# Altium schematic sheet SCH_Clock_Iot.SchDoc
size A3
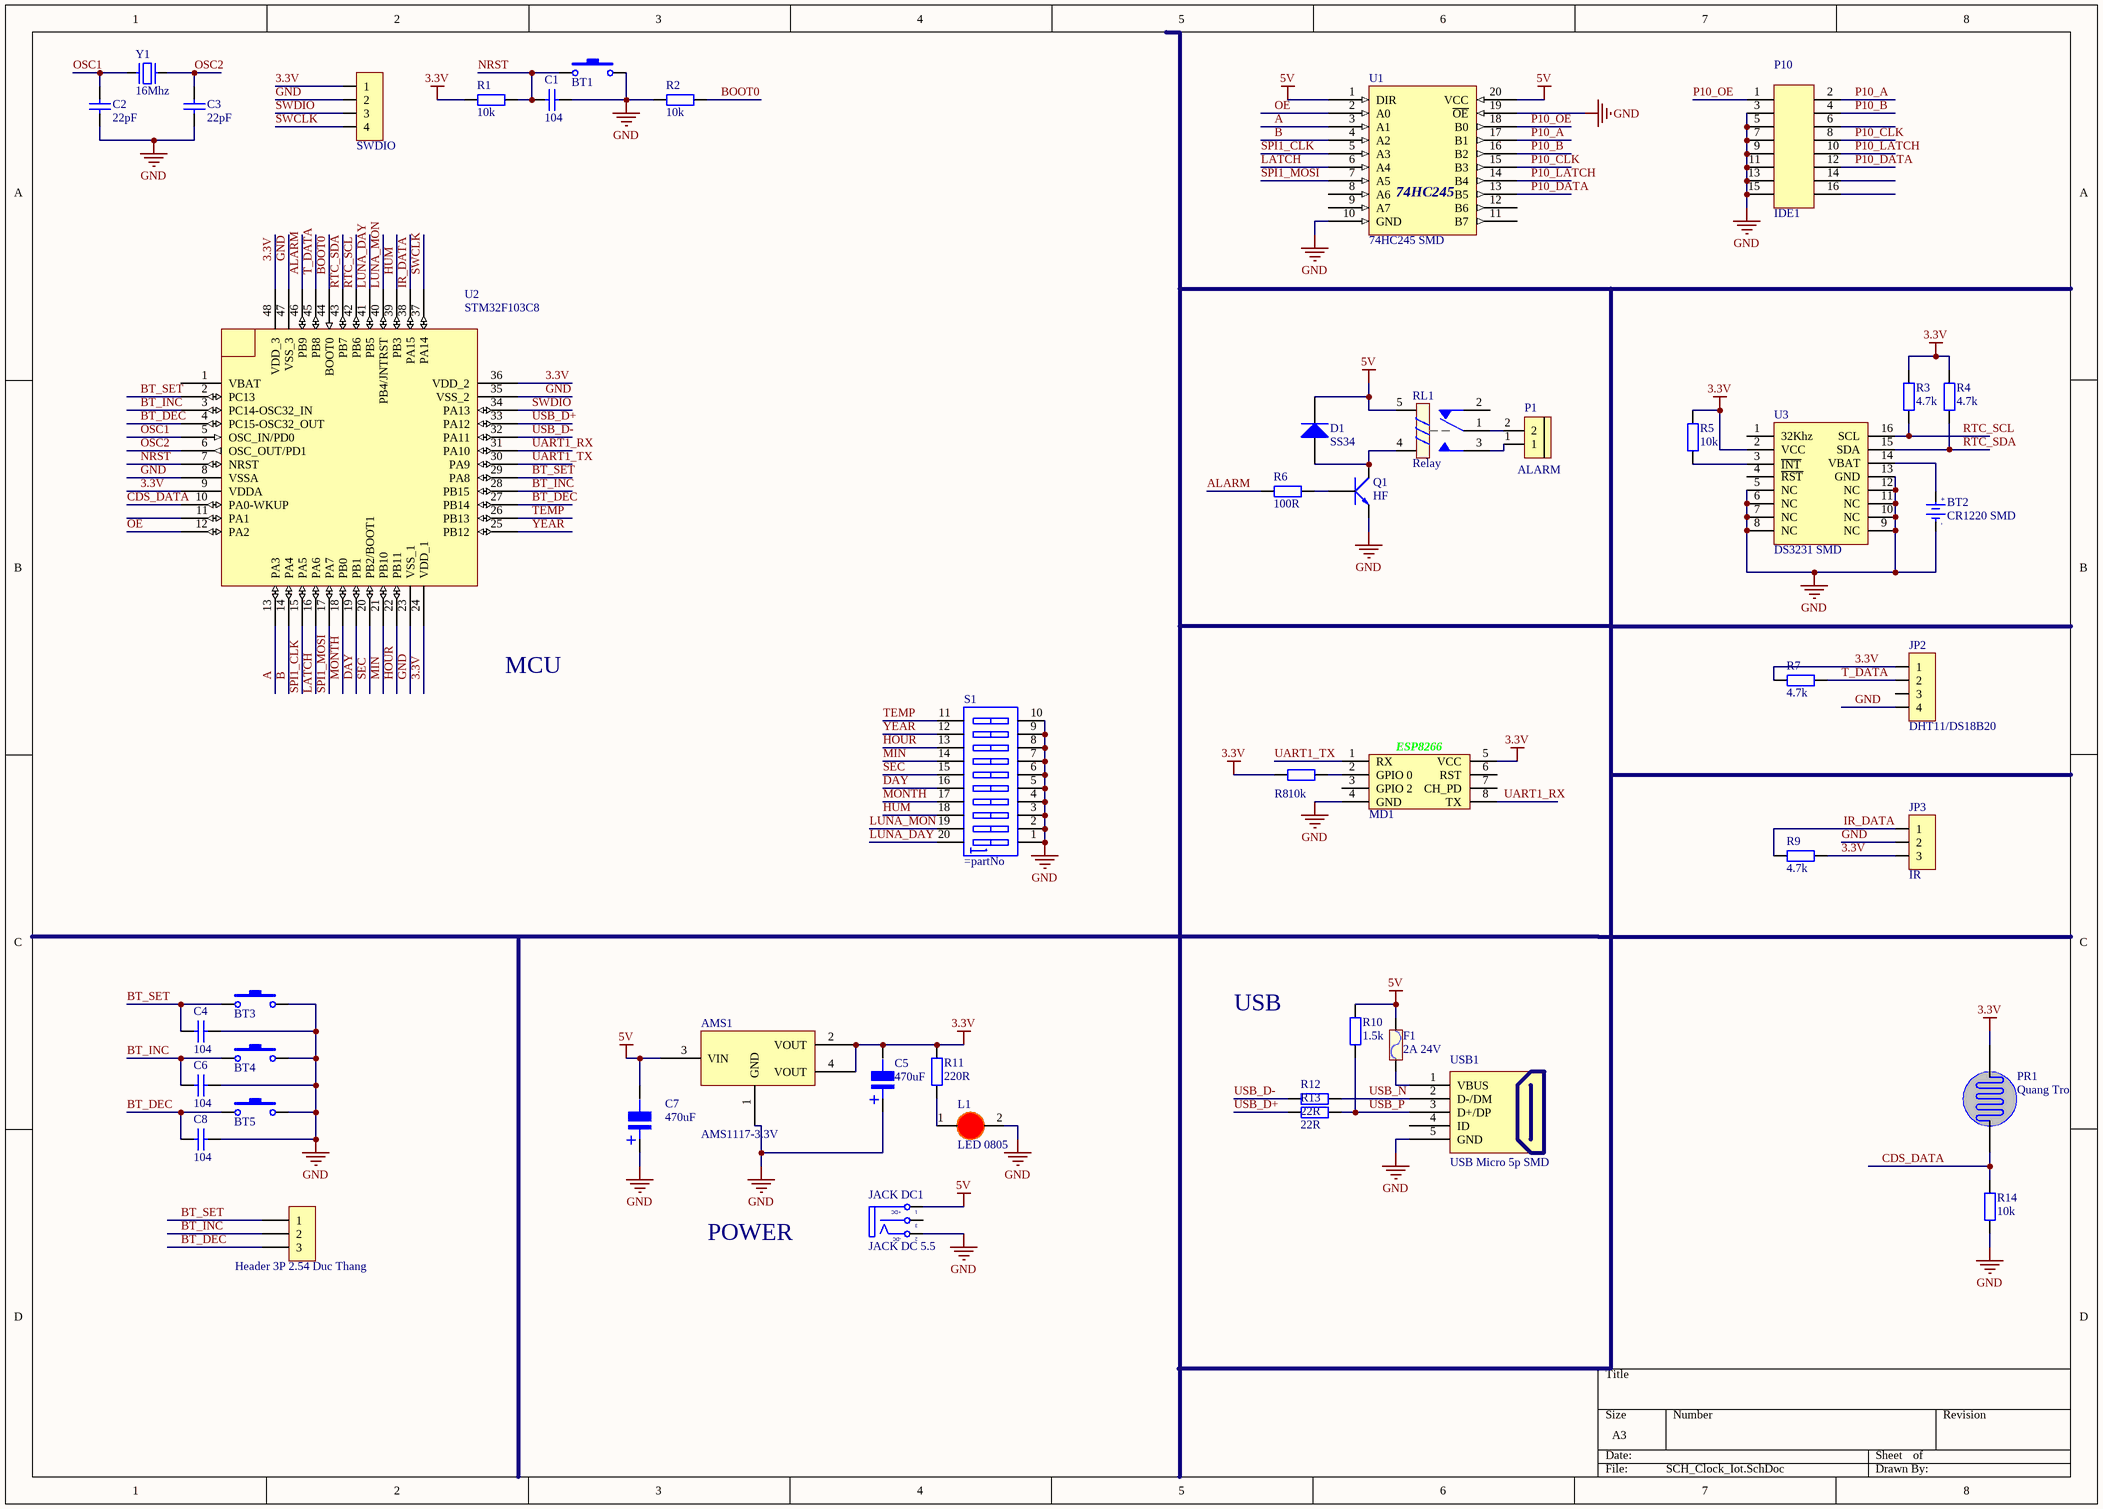
[diagram p0: SCH_Clock_Iot.SchDoc]

## Parts
AMS1  AMS1117-3.3V  [SOT223]
BT1  Nut Nhan 2 Chan SMD 3x6x2.5  [Nut Nhan 2 Chan SMD 3x6x2.5]  (value not drawn)
BT2  CR1220 SMD  [DE PIN CR1220]
BT3  Nut Nhan 2 Chan SMD 3x6x2.5  [Nut Nhan 2 Chan SMD 3x6x2.5]  (value not drawn)
BT4  Nut Nhan 2 Chan SMD 3x6x2.5  [Nut Nhan 2 Chan SMD 3x6x2.5]  (value not drawn)
BT5  Nut Nhan 2 Chan SMD 3x6x2.5  [Nut Nhan 2 Chan SMD 3x6x2.5]  (value not drawn)
C1  104  [tu 0805]
C2  22pF  [tu 0805]
C3  22pF  [tu 0805]
C4  104  [tu 0805]
C5  470uF  [tu nhom 8 (f)]
C6  104  [tu 0805]
C7  470uF  [tu nhom 8 (f)]
C8  104  [tu 0805]
D1  SS34  [DIODE SMA]
F1  2A 24V  [Cau chi tu phuc hoi 2A 24V SMD1812]
H1  Header 3P 2.54 Duc Thang  [Header DT 3P_2.54]
IDE1  P10  [IDE16 DT]
JACK_DC1  JACK DC 5.5  [JACK DC 5.5]
JP1  SWDIO  [JP 1x4 DT]
JP2  DHT11/DS18B20  [JP 1x4 CT]
JP3  IR  [JP 1x3 CT]
L1  LED 0805  [LED-0805-Red]
MD1  ESP8266 Module  [ESP2866 Module]  (value not drawn)
P1  ALARM  [CON 2 2EDG5.08]
PR1  Quang Tro  [Quang Tro]
Q1  HF  [SOT23]
R1  10k  [tro smd 0805]
R2  10k  [tro smd 0805]
R3  4.7k  [tro smd 0805]
R4  4.7k  [tro smd 0805]
R5  10k  [tro smd 0805]
R6  100R  [tro smd 0805]
R7  4.7k  [tro smd 0805]
R8  10k  [tro smd 0805]
R9  4.7k  [tro smd 0805]
R10  1.5k  [tro smd 0805]
R11  220R  [tro smd 0805]
R12  22R  [tro smd 0805]
R13  22R  [tro smd 0805]
R14  10k  [tro smd 0805]
RL1  Relay  [Relay 5 Chan SRD]
S1  (no value)  [SW-DIP10-1]
U1  74HC245 SMD  [TSSOP20]
U2  STM32F103C8  [STM32_LQPF48]
U3  DS3231 SMD  [SOIC 16]
USB1  USB Micro 5p SMD  [USB Micro 5p SMD]
Y1  16Mhz  [Thach Anh 2 chan cam]

## Nets
3.3V: AMS1.2(VOUT) AMS1.4(VOUT) C5.2 JP1.1 JP2.1 JP3.3 MD1.5(VCC) PR1.2 R1.2 R3.2 R4.2 R5.2 R7.2 R8.2 R9.1 R11.2 U2.9(VDDA) U2.24(VDD_1) U2.36(VDD_2) U2.48(VDD_3) U3.2(VCC)
5V: AMS1.3(VIN) C7.2 D1.2(K) F1.2 JACK_DC1.1(T) R10.1 RL1.5 U1.1(DIR) U1.20(VCC)
GND: AMS1.1(GND) BT1.2 BT2.2(GND) BT3.2 BT4.2 BT5.2 C1.2 C2.2 C3.2 C4.2 C5.1 C6.2 C7.1 C8.2 IDE1.3 IDE1.5 IDE1.7 IDE1.9 IDE1.11 IDE1.13 IDE1.15 JACK_DC1.2(TN) JP1.2 JP2.4 JP3.2 L1.2(K) MD1.4(GND) Q1.2(E) R2.2 R14.1 S1.1 S1.2 S1.3 S1.4 S1.5 S1.6 S1.7 S1.8 S1.9 S1.10 U1.10(GND) U1.19(~{OE}) U2.8(VSSA) U2.23(VSS_1) U2.35(VSS_2) U2.47(VSS_3) U3.5(NC) U3.6(NC) U3.7(NC) U3.8(NC) U3.9(NC) U3.10(NC) U3.11(NC) U3.12(NC) U3.13(GND) USB1.5(GND)
A: U1.3(A1) U2.13(PA3)
ALARM: R6.1 U2.46(PB9)
B: U1.4(A2) U2.14(PA4)
BOOT0: R2.1 U2.44(BOOT0)
BT_DEC: BT5.1 C8.1 H1.3 U2.4(PC15-OSC32_OUT) U2.27(PB14)
BT_INC: BT4.1 C6.1 H1.2 U2.3(PC14-OSC32_IN) U2.28(PB15)
BT_SET: BT3.1 C4.1 H1.1 U2.2(PC13) U2.29(PA8)
CDS_DATA: PR1.1 R14.2 U2.10(PA0-WKUP)
DAY: S1.16 U2.19(PB1)
HOUR: S1.13 U2.22(PB11)
HUM: S1.18 U2.39(PB3)
IR_DATA: JP3.1 R9.2 U2.38(PA15)
LATCH: U1.6(A4) U2.16(PA6)
LUNA_DAY: S1.20 U2.41(PB5)
LUNA_MON: S1.19 U2.40(PB4/JNTRST)
MIN: S1.14 U2.21(PB10)
MONTH: S1.17 U2.18(PB0)
NRST: BT1.1 C1.1 R1.1 U2.7(NRST)
OE: U1.2(A0) U2.12(PA2)
OSC1: C2.1 U2.5(OSC_IN/PD0) Y1.1
OSC2: C3.1 U2.6(OSC_OUT/PD1) Y1.2
P10_A: IDE1.2 U1.17(B1)
P10_B: IDE1.4 U1.16(B2)
P10_CLK: IDE1.8 U1.15(B3)
P10_DATA: IDE1.12 U1.13(B5)
P10_LATCH: IDE1.10 U1.14(B4)
P10_OE: IDE1.1 U1.18(B0)
RTC_SCL: R3.1 U2.42(PB6) U3.16(SCL)
RTC_SDA: R4.1 U2.43(PB7) U3.15(SDA)
SEC: S1.15 U2.20(PB2/BOOT1)
SPI1_CLK: U1.5(A3) U2.15(PA5)
SPI1_MOSI: U1.7(A5) U2.17(PA7)
SWCLK: JP1.4 U2.37(PA14)
SWDIO: JP1.3 U2.34(PA13)
T_DATA: JP2.2 R7.1 U2.45(PB8)
TEMP: S1.11 U2.26(PB13)
UART1_RX: MD1.8(TX) U2.31(PA10)
UART1_TX: MD1.1(RX) U2.30(PA9)
USB_D+: R13.1 U2.33(PA12)
USB_D-: R12.1 U2.32(PA11)
USB_N: R12.2 USB1.2(D-/DM)
USB_P: R10.2 R13.2 USB1.3(D+/DP)
YEAR: S1.12 U2.25(PB12)
NetBT2_1: BT2.1(+3V) U3.14(VBAT)
NetD1_1: D1.1(A) Q1.3(C) RL1.4
NetF1_1: F1.1 USB1.1(VBUS)
NetL1_1: L1.1(A) R11.1
NetMD1_2: MD1.2(GPIO_0) R8.1
NetP1_1: P1.1 RL1.3
NetP1_2: P1.2 RL1.1
NetQ1_1: Q1.1(B) R6.2
NetR5_1: R5.1 U3.3(~{INT})

Not connected (* = marked no-connect by the designer): IDE1 6 14 16(14); JACK_DC1 3(S); JP2 3; MD1 3(GPIO_2) 6(RST) 7(CH_PD); RL1 2; U1 8(A6) 9(A7) 11(B7) 12(B6); U2 1(VBAT) 11(PA1); U3 1(32Khz) 4(~{RST}); USB1 4(ID)

## Notes on the sheet
- MCU
- USB
- POWER
- (in symbol 74HC245 SMD) 74HC245
- (in symbol De pin CR1220 SMD) +; -
- (in symbol ESP8266 Module) ESP8266
- (in symbol JACK DC 5.5) +DC; -DC
- (in symbol Tu Nhom 470uF 16V) +

## Library data of the parts
AMS1 = AMS1117 SMD: Dán; Value: AMS1117-3.3V SOT223; Don_Vi: Con; Ma_Hang: MH000596; Ghi_Chu: *; Kieu_Chan: *; Chung_Loai: Dán
BT1 BT3-BT5 = Nut Nhan 2 Chan SMD 3x6x2.5: Ma_Hang: MH001036; Ten: Nút Nhấn 2 Chân 3x6x2.5MM SMD
BT2 = De pin CR1220 SMD: Ten: Đế PIN CR1220 SMD; Ma_Hang: MH000833
C1 C4 C6 C8 = Tu 0805 104 50V 10%: Dán; Don_Vi: Con; So_Chan: 2; Ten_Linh_Kien: Tụ 0805 104-100nF 10% 50V; Ma_Hang: MH004551; Chung_Loai: Dán; Kieu_Chan: *
C2 C3 = Tu 0805 22pF 50V 10%: Dán; Don_Vi: Con; So_Chan: 2; Ten_Linh_Kien: Tụ 0805 22P 10% 50V; Ma_Hang: MH004560; Chung_Loai: Dán; Kieu_Chan: *
C5 C7 = Tu Nhom 470uF 16V: Dán; Don_Vi: Con; So_Chan: 2; Ten_Linh_Kien: Tụ Nhôm 470uF 16V 8x10.4MM; Ma_Hang: MH001940; Chung_Loai: Dán; Kieu_Chan: *
D1 = Diode SS34 ( 1N5822 ): Dán; Don_Vi: Con; Ma_Hang: MH002104; Ten_Linh_Kien: Diode SS34 3A 40V SMA ( 1N5822 SS34A); Kieu_Chan: *; Chung_Loai: Dán
F1 = Cau chi tu phuc hoi 2A 24V SMD1812: 2A 24V SMD1812; Ma_Hang: MH010033; Ten: Cầu Chì Tự Phục Hồi 2A 24V SMD1812
H1 = Header 3P 2.54 Duc Thang: Cắm; Ten_Linh_Kien: Header 3P XH2.54-3P Đực Thẳng; Don_Vi: Con; Ma_Hang: MH001292; Chung_Loai: Cắm
IDE1 = IDE 16 DT
JACK_DC1 = JACK DC 5.5: Value: Jac DC
JP1 = JP 1x4 2.54 Duc Thang: Cắm; Ten_Linh_Kien: Jump Đơn Đực 2.54MM 1x40P Thẳng 11MM; Don_Vi: Con; Ma_Hang: MH000903; Ghi_Chu: *; Kieu_Chan: *; Chung_Loai: Cắm
JP2 = JP 1x4 2.54 Cai Thang: Cắm; Ten_Linh_Kien: Jump Đơn Cái 2.54MM 1x20P Thẳng; Don_Vi: Con; Ma_Hang: MH004006; Ghi_Chu: *; Kieu_Chan: *; Chung_Loai: Cắm
JP3 = JP 1x3 2.54 Cai Thang: Cắm; Ten_Linh_Kien: Jump Đơn Cái 2.54MM 1x20P Thẳng; Don_Vi: Con; Ma_Hang: MH004006; Ghi_Chu: *; Kieu_Chan: *; Chung_Loai: Cắm
L1 = LED 0805 Do: Dán; Don_Vi: Con; Ma_Hang: MH000897; Ten_Linh_Kien: LED 0805 Màu Đỏ (Red); Ghi_Chu: *; Kieu_Chan: *; Chung_Loai: Dán
P1 = CON 2 EDG5.08: Cắm; Ten_Linh_Kien: CON 2 2EDG5.08-2P 5.08MM ( Xanh Cong); Don_Vi: Con; Ma_Hang: MH000759; Ghi_Chu: *; Kieu_Chan: *; Chung_Loai: Cắm
PR1 = Quang Tro: Photoresistor; Creator: Bien Nguyen
Q1 = C1815 HF SMD: NPN transistor; Value: C9014
R1 R2 R5 R8 R14 = Tro 0805 5% 10k: Dán; Don_Vi: Con; So_Chan: 2; Ten_Linh_Kien: Trở 0805 5% 10k; Ma_Hang: MH005239; Chung_Loai: Dán; Kieu_Chan: *
R3 R4 R7 R9 = Tro 0805 5% 4.7k: Dán; Don_Vi: Con; So_Chan: 2; Ten_Linh_Kien: Trở 0805 5% 4.7k; Ma_Hang: MH005307; Chung_Loai: Dán; Kieu_Chan: *
R6 = Tro 0805 5% 100R: Dán; Don_Vi: Con; So_Chan: 2; Ten_Linh_Kien: Trở 0805 5% 100R; Ma_Hang: MH005251; Chung_Loai: Dán; Kieu_Chan: *
R10 = Tro 0805 5% 1.5k: Dán; Don_Vi: Con; So_Chan: 2; Ten_Linh_Kien: Trở 0805 5% 1.5k; Ma_Hang: MH005232; Chung_Loai: Dán; Kieu_Chan: *
R11 = Tro 0805 5% 220R: Dán; Don_Vi: Con; So_Chan: 2; Ten_Linh_Kien: Trở 0805 5% 220R; Ma_Hang: MH005259; Chung_Loai: Dán; Kieu_Chan: *
R12 R13 = Tro 0805 5% 22R: Dán; Don_Vi: Con; So_Chan: 2; Ten_Linh_Kien: Trở 0805 5% 22R; Ma_Hang: MH005249; Chung_Loai: Dán; Kieu_Chan: *
RL1 = Relay 5 Chan SRD: Relay 5 Chan; Ma_Hang: MH009374; Ten: Relay 5V10A SRD-05VDC-SL-C Chính Hãng
S1 = SWDIP10: WS-DITV 2.54 mm small compact THT flat actuator with top tape; Manufacturer: Wurth Elektronik; Part No.: 418127160910; ComponentLink1 Description: Manufacturer; ComponentLink2 Description: Datasheet; Pole: 10; Created Date: Dec.2015; ComponentLink1URL: http://www.we-online.com; ComponentLink2URL: http://katalog.we-online.de/em/datasheet/4181271609xx.pdf; Created by: Baojun Chen
U1 = 74HC245 SMD: Dán; Ten_Linh_Kien: 74HC245DW SSOP20 5.2MM; Don_Vi: Con; Ma_Hang: MH003571; Ghi_Chu: *; Kieu_Chan: *; Chung_Loai: Dán
U2 = STM32F103xx_LQFP48: Published: 30-May-2008; DatasheetVersion: rev6, Mar-2008; PackageVersion: Mar-2008; PackageReference: LQFP48; Publisher: Altium Limited; PackageDescription: 48-Pin Low-Profile Quad Flat Pack, 7 x 7 mm Body, 0.5 mm Pitch (LQFP48); ComponentLink1Description: Manufacturer Link; ComponentLink1URL: www.st.com/stm32; ComponentLink2Description: Datasheet; ComponentLink2URL: http://www.st.com/stonline/products/literature/ds/13587.pdf
U3 = DS3231 SMD: SOIC
USB1 = USB Micro 5p SMD: USB Type B; Ten: MicroUSB MK5P SMD; Ma_Hang: MH001020
Y1 = Thach Anh 2 chan Cam: Crystal For all Crystal 2pin.; Value: 4Mhz